# EAGLE design psu_ctrl_brd (EAGLE 7.2.0)

## Sheet 1 of 2
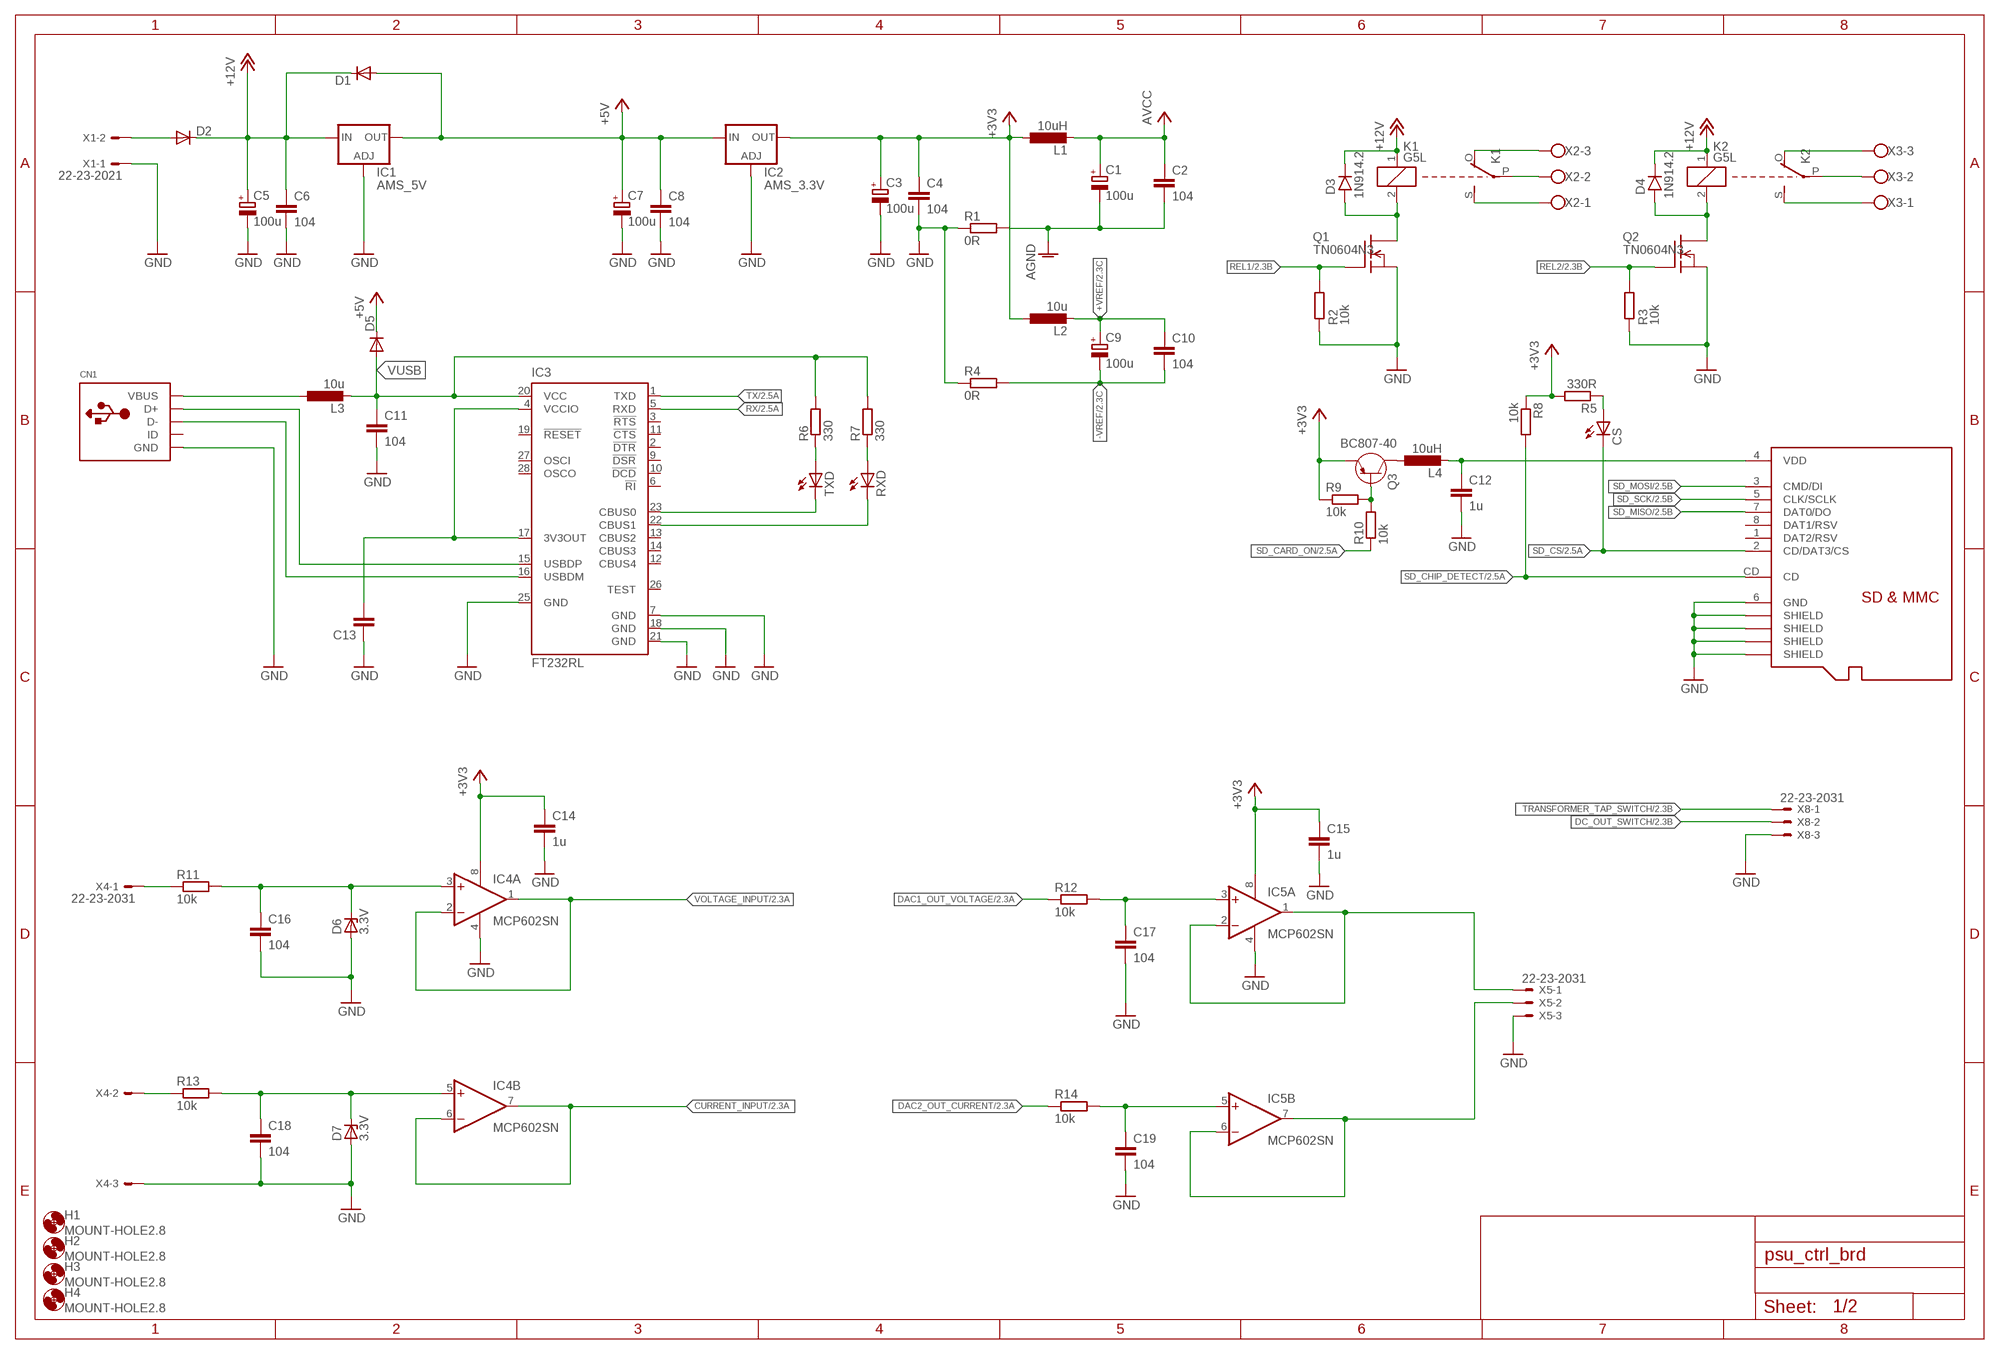
[diagram p0: schematic, sheet 1]

### Parts
C1  100u  CPOL-EU153CLV-0505  [153CLV-0505]
C2  104  C-EUC0805  [C0805]
C3  100u  CPOL-EU153CLV-0505  [153CLV-0505]
C4  104  C-EUC0805  [C0805]
C5  100u  CPOL-EU153CLV-0505  [153CLV-0505]
C6  104  C-EUC0805  [C0805]
C7  100u  CPOL-EU153CLV-0505  [153CLV-0505]
C8  104  C-EUC0805  [C0805]
C9  100u  CPOL-EU153CLV-0505  [153CLV-0505]
C10  104  C-EUC0805  [C0805]
C11  104  C-EUC0805  [C0805]
C12  1u  C-EUC0805  [C0805]
C13  C-EUC0805  [C0805]
C14  1u  C-EUC0805  [C0805]
C15  1u  C-EUC0805  [C0805]
C16  104  C-EUC0805  [C0805]
C17  104  C-EUC0805  [C0805]
C18  104  C-EUC0805  [C0805]
C19  104  C-EUC0805  [C0805]
CN1  USBMINIB  [USB-MINIB]
CS  LEDCHIPLED_1206  [CHIPLED_1206]
D1  DIODE-DO-214AC  [DO-214AC]
D2  DIODE-DO-214AC  [DO-214AC]
D3  1N914.2  [DO35-2]
D4  1N914.2  [DO35-2]
D5  DIODE-DO-214AC  [DO-214AC]
D6  3.3V  BZD23  [SOD81]
D7  3.3V  BZD23  [SOD81]
H1  MOUNT-HOLE2.8  [2,8]
H2  MOUNT-HOLE2.8  [2,8]
H3  MOUNT-HOLE2.8  [2,8]
H4  MOUNT-HOLE2.8  [2,8]
IC1  AMS_5V  LD117AS50TR  [SOT223]
IC2  AMS_3.3V  LD117AS50TR  [SOT223]
IC3  FT232RL  [SSOP28]
IC4  MCP602SN  [SO08]
IC5  MCP602SN  [SO08]
K1  G5L  [G5LE]
K2  G5L  [G5LE]
L1  10uH  L-EU0207/2V  [0207/2V]
L2  10u  L-EU0207/2V  [0207/2V]
L3  10u  L-EU0207/2V  [0207/2V]
L4  10uH  L-EU0207/2V  [0207/2V]
Q1  TN0604N3  [TO-92]
Q2  TN0604N3  [TO-92]
Q3  BC807-40  [SOT23]
R1  0R  R-EU_M0805  [M0805]
R2  10k  R-EU_R0805  [R0805]
R3  10k  R-EU_R0805  [R0805]
R4  0R  R-EU_M0805  [M0805]
R5  330R  R-EU_M0805  [M0805]
R6  330  R-EU_M0805  [M0805]
R7  330  R-EU_M0805  [M0805]
R8  10k  R-EU_M0805  [M0805]
R9  10k  R-EU_M0805  [M0805]
R10  10k  R-EU_M0805  [M0805]
R11  10k  R-EU_M0805  [M0805]
R12  10k  R-EU_M0805  [M0805]
R13  10k  R-EU_M0805  [M0805]
R14  10k  R-EU_M0805  [M0805]
RXD  LEDCHIPLED_1206  [CHIPLED_1206]
TXD  LEDCHIPLED_1206  [CHIPLED_1206]
U$1  MICROSD  [C12075]
X1  22-23-2021  [22-23-2021]
X2  AK500/3  [AK500/3]
X3  AK500/3  [AK500/3]
X4  22-23-2031  [22-23-2031]
X5  22-23-2031  [22-23-2031]
X8  22-23-2031  [22-23-2031]

### Nets
+3V3: C3.+ C4.1 C14.1 C15.1 IC2.4(OUT) IC4.8(P:V+) IC5.8(P:V+) L1.1 L2.1 Q3.2(E) R5.2 R8.1 R9.1 ; also sheet 2
+5V: C7.+ C8.1 D1.A D5.C IC1.4(OUT) IC2.3(IN) ; also sheet 2
+12V: C5.+ C6.1 D1.C D2.C D3.C D4.C IC1.3(IN) K1.1 K2.1 ; also sheet 2
+VREF: C9.+ C10.1 L2.2 ; also sheet 2
-VREF: C9.- C10.2 R4.2 ; also sheet 2
AGND: C1.- C2.2 R1.2 ; also sheet 2
AVCC: C1.+ C2.1 L1.2 ; also sheet 2
CURRENT_INPUT: IC4.6(B:-IN) IC4.7(B:OUT) ; also sheet 2
DAC1_OUT_VOLTAGE: R12.1 ; also sheet 2
DAC2_OUT_CURRENT: R14.1 ; also sheet 2
DC_OUT_SWITCH: X8.2 ; also sheet 2
GND: C3.- C4.2 C5.- C6.2 C7.- C8.2 C11.2 C12.2 C13.1 C14.2 C15.2 C16.2 C17.2 C18.2 C19.2 CN1.GND D6.A D7.A IC1.1(ADJ) IC2.1(ADJ) IC3.7(GND) IC3.18(GND) IC3.21(GND) IC3.25(GND) IC4.4(P:V-) IC5.4(P:V-) Q1.1(S) Q2.1(S) R1.1 R2.1 R3.1 R4.1 U$1.6(GND) U$1.GND@1(SHIELD) U$1.GND@2(SHIELD) U$1.GND@3(SHIELD) U$1.GND@4(SHIELD) X1.1 X4.3 X5.3 X8.3 ; also sheet 2
N$2: CN1.D+ IC3.15(USBDP)
N$3: CN1.VBUS L3.1
N$4: R7.1 RXD.A
N$5: C13.2 IC3.4(VCCIO) IC3.17(3V3OUT)
N$6: CN1.D- IC3.16(USBDM)
N$7: R6.1 TXD.A
N$8: D2.A X1.2
N$9: IC3.23(CBUS0) TXD.C
N$10: IC3.22(CBUS1) RXD.C
N$11: R11.1 X4.1
N$12: C16.1 D6.C IC4.3(A:+IN) R11.2
N$13: R13.1 X4.2
N$15: C18.1 D7.C IC4.5(B:+IN) R13.2
N$23: C17.1 IC5.3(A:+IN) R12.2
N$24: IC5.1(A:OUT) IC5.2(A:-IN) X5.1
N$26: C19.1 IC5.5(B:+IN) R14.2
N$27: IC5.6(B:-IN) IC5.7(B:OUT) X5.2
N$36: D4.A K2.2 Q2.3(D)
N$37: L4.1 Q3.3(C)
N$38: C12.1 L4.2 U$1.4(VDD)
N$40: K1.O(2:O) X2.3
N$41: K1.S(2:S) X2.1
N$42: D3.A K1.2 Q1.3(D)
N$43: K1.P(2:P) X2.2
N$44: K2.O(2:O) X3.3
N$45: K2.P(2:P) X3.2
N$46: K2.S(2:S) X3.1
N$47: Q3.1(B) R9.2 R10.2
N$48: CS.A R5.1
REL1: Q1.2(G) R2.2 ; also sheet 2
REL2: Q2.2(G) R3.2 ; also sheet 2
RX: IC3.5(RXD) ; also sheet 2
SD_CARD_ON: R10.1 ; also sheet 2
SD_CHIP_DETECT: R8.2 U$1.CD ; also sheet 2
SD_CS: CS.C U$1.2(CD/DAT3/CS) ; also sheet 2
SD_MISO: U$1.7(DAT0/DO) ; also sheet 2
SD_MOSI: U$1.3(CMD/DI) ; also sheet 2
SD_SCK: U$1.5(CLK/SCLK) ; also sheet 2
TRANSFORMER_TAP_SWITCH: X8.1 ; also sheet 2
TX: IC3.1(TXD) ; also sheet 2
VOLTAGE_INPUT: IC4.1(A:OUT) IC4.2(A:-IN) ; also sheet 2
VUSB: C11.1 D5.A IC3.20(VCC) L3.2 R6.2 R7.2
Unconnected: CN1.ID IC3.2(!DTR) IC3.3(!RTS) IC3.6(!RI) IC3.9(!DSR) IC3.10(!DCD) IC3.11(!CTS) IC3.12(CBUS4) IC3.13(CBUS2) IC3.14(CBUS3) IC3.19(!RESET) IC3.26(TEST) IC3.27(OSCI) IC3.28(OSCO) U$1.1(DAT2/RSV) U$1.8(DAT1/RSV)

## Sheet 2 of 2
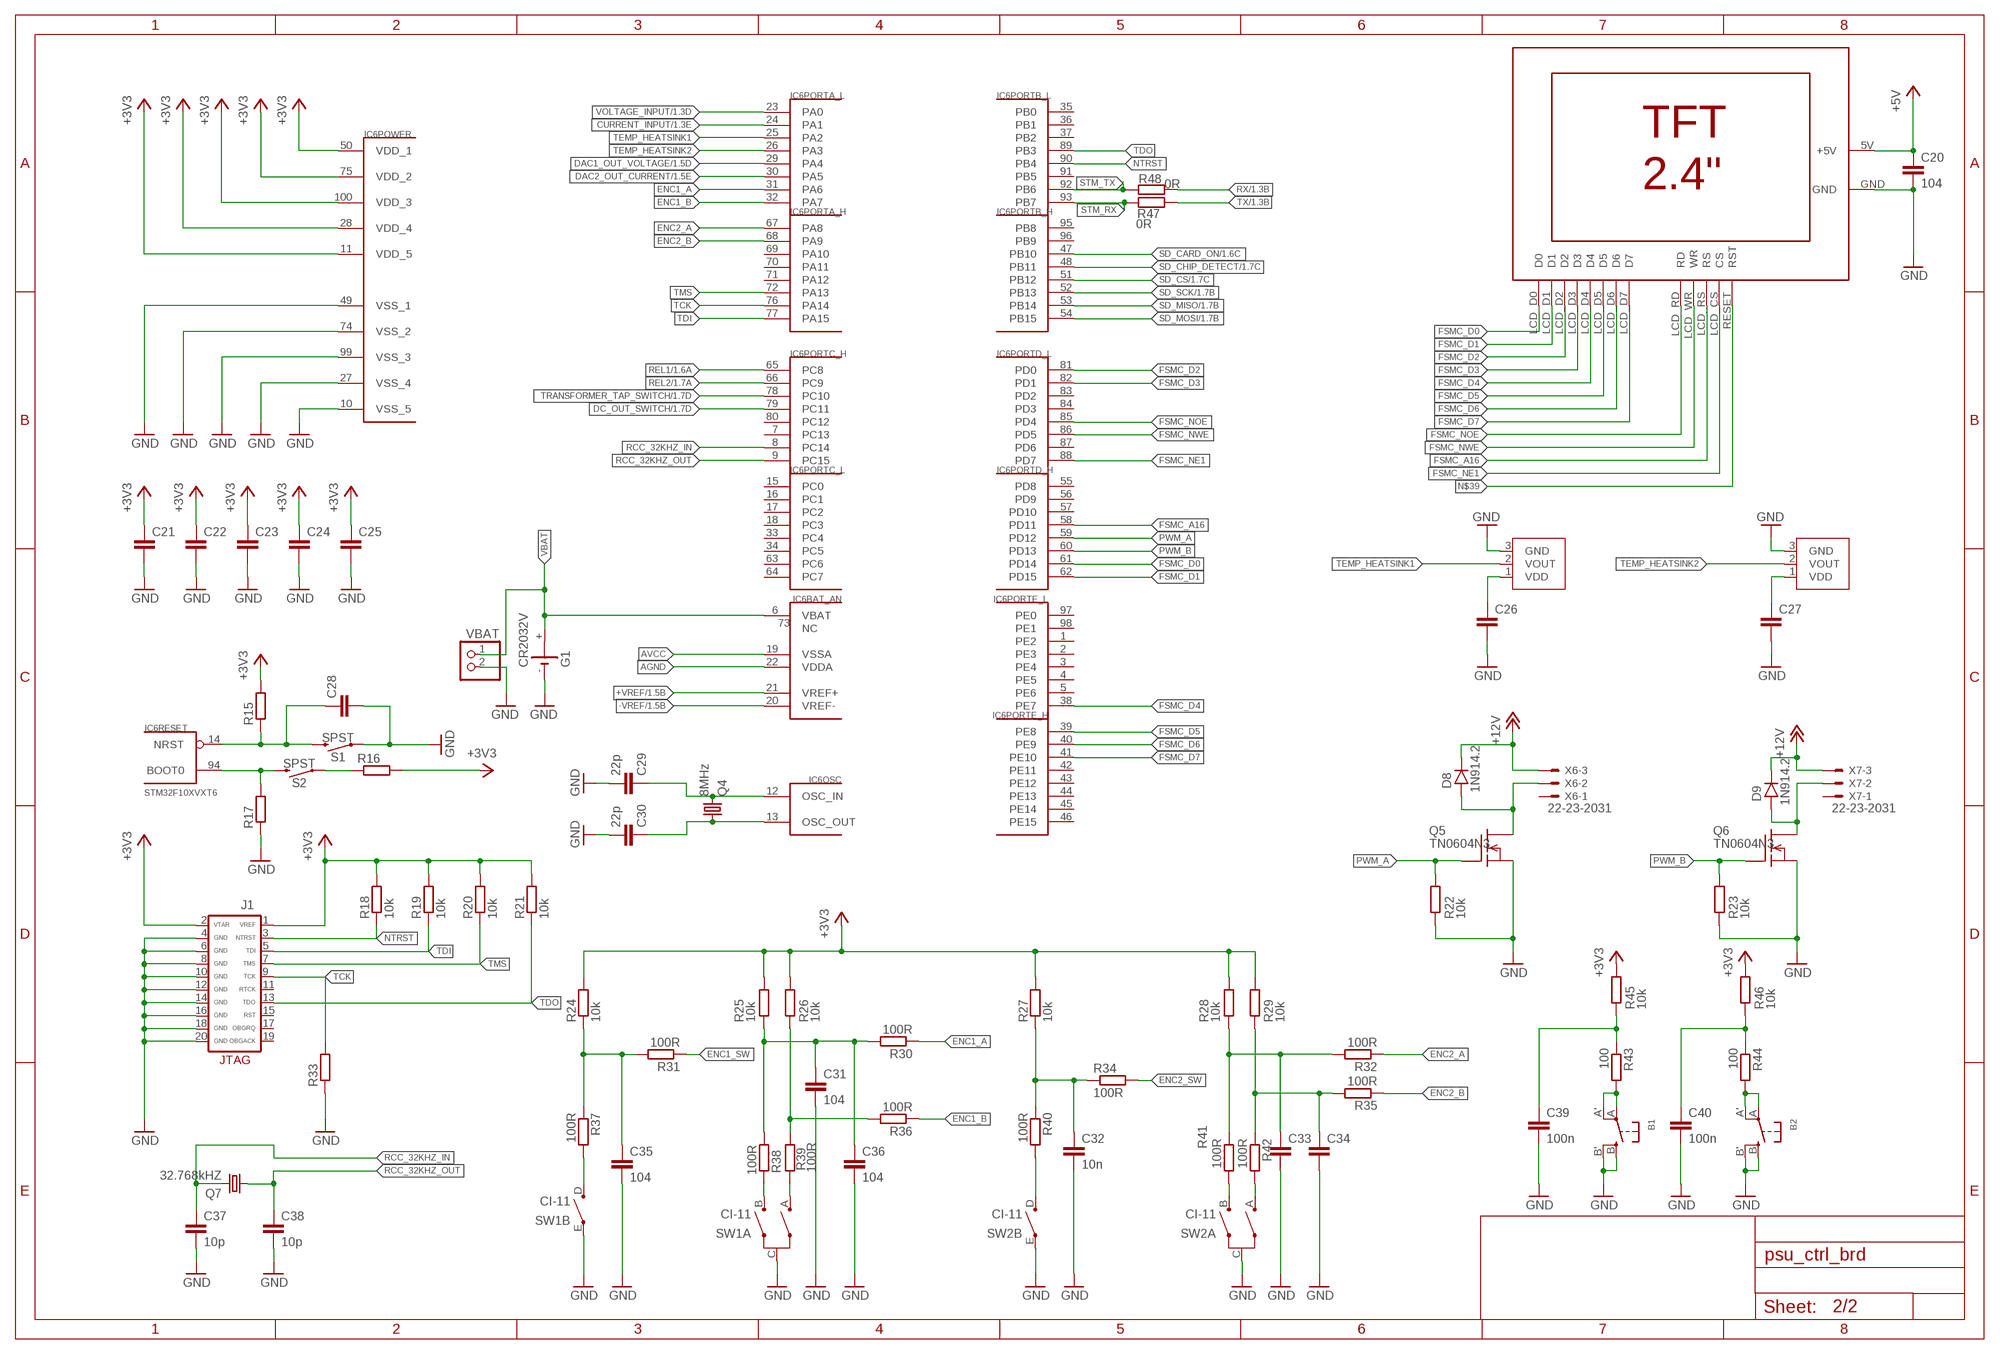
[diagram p1: schematic, sheet 2]

### Parts
B1  SWITCH_TACT_SMT  [EVQ-Q2]
B2  SWITCH_TACT_SMT  [EVQ-Q2]
C20  104  C-EUC0805  [C0805]
C21  C-EUC0805  [C0805]
C22  C-EUC0805  [C0805]
C23  C-EUC0805  [C0805]
C24  C-EUC0805  [C0805]
C25  C-EUC0805  [C0805]
C26  C-EUC0805  [C0805]
C27  C-EUC0805  [C0805]
C28  C-EUC0805  [C0805]
C29  22p  C-EUC0805  [C0805]
C30  22p  C-EUC0805  [C0805]
C31  104  C-EUC0805  [C0805]
C32  10n  C-EUC0805  [C0805]
C33  C-EUC0805  [C0805]
C34  C-EUC0805  [C0805]
C35  104  C-EUC0805  [C0805]
C36  104  C-EUC0805  [C0805]
C37  10p  C-EUC0805  [C0805]
C38  10p  C-EUC0805  [C0805]
C39  100n  C-EUC0805  [C0805]
C40  100n  C-EUC0805  [C0805]
D8  1N914.2  [DO35-2]
D9  1N914.2  [DO35-2]
G1  CR2032V  [CR2032V]
IC6  STM32F10XVXT6  [TQFP100]
J1  JTAG-ARM-PAK100/2500-20  [PAK100/2500-20]
MCP97X_1  MCP970XTO  [TO92]
MCP97X_2  MCP970XTO  [TO92]
Q4  8MHz  CSM-7X-DU  [CSM-7X-DU]
Q5  TN0604N3  [TO-92]
Q6  TN0604N3  [TO-92]
Q7  32.768kHZ  CRYSTALTC26V  [TC26V]
R15  R-EU_R0805  [R0805]
R16  R-EU_R0805  [R0805]
R17  R-EU_R0805  [R0805]
R18  10k  R-EU_R0805  [R0805]
R19  10k  R-EU_R0805  [R0805]
R20  10k  R-EU_R0805  [R0805]
R21  10k  R-EU_R0805  [R0805]
R22  10k  R-EU_R0805  [R0805]
R23  10k  R-EU_R0805  [R0805]
R24  10k  R-EU_R0805  [R0805]
R25  10k  R-EU_R0805  [R0805]
R26  10k  R-EU_R0805  [R0805]
R27  10k  R-EU_R0805  [R0805]
R28  10k  R-EU_R0805  [R0805]
R29  10k  R-EU_R0805  [R0805]
R30  100R  R-EU_R0805  [R0805]
R31  100R  R-EU_R0805  [R0805]
R32  100R  R-EU_R0805  [R0805]
R33  R-EU_R0805  [R0805]
R34  100R  R-EU_R0805  [R0805]
R35  100R  R-EU_R0805  [R0805]
R36  100R  R-EU_R0805  [R0805]
R37  100R  R-EU_R0805  [R0805]
R38  100R  R-EU_R0805  [R0805]
R39  100R  R-EU_R0805  [R0805]
R40  100R  R-EU_R0805  [R0805]
R41  100R  R-EU_R0805  [R0805]
R42  100R  R-EU_R0805  [R0805]
R43  100  R-EU_R0805  [R0805]
R44  100  R-EU_R0805  [R0805]
R45  10k  R-EU_R0805  [R0805]
R46  10k  R-EU_R0805  [R0805]
R47  0R  R-EU_R0805  [R0805]
R48  0R  R-EU_R0805  [R0805]
S1  SPST  MOMENTARY-SWITCH-SPST-SMD-6.0X3.5MM  [TACTILE_SWITCH_SMD_6.0X3.5MM]
S2  SPST  MOMENTARY-SWITCH-SPST-SMD-6.0X3.5MM  [TACTILE_SWITCH_SMD_6.0X3.5MM]
SW1  CI-11  [CI-11]
SW2  CI-11  [CI-11]
U$2  TFT24  [A]
VBAT  PINHD-1X2  [1X02]
X6  22-23-2031  [22-23-2031]
X7  22-23-2031  [22-23-2031]

### Nets
+3V3: C21.1 C22.1 C23.1 C24.1 C25.1 IC6.11(POWER:VDD_5) IC6.28(POWER:VDD_4) IC6.50(POWER:VDD_1) IC6.75(POWER:VDD_2) IC6.100(POWER:VDD_3) J1.1(VREF) J1.2(VTAR) R15.2 R16.2 R18.2 R19.2 R20.2 R21.2 R24.2 R25.2 R26.2 R27.2 R28.2 R29.2 R45.2 R46.2 ; also sheet 1
+5V: C20.1 U$2.5V(+5V) ; also sheet 1
+12V: D8.C D9.C X6.3 X7.3 ; also sheet 1
+VREF: IC6.21(BAT_AN:VREF+) ; also sheet 1
-VREF: IC6.20(BAT_AN:VREF-) ; also sheet 1
AGND: IC6.22(BAT_AN:VDDA) ; also sheet 1
AVCC: IC6.19(BAT_AN:VSSA) ; also sheet 1
CURRENT_INPUT: IC6.24(PORTA_L:PA1) ; also sheet 1
DAC1_OUT_VOLTAGE: IC6.29(PORTA_L:PA4) ; also sheet 1
DAC2_OUT_CURRENT: IC6.30(PORTA_L:PA5) ; also sheet 1
DC_OUT_SWITCH: IC6.79(PORTC_H:PC11) ; also sheet 1
ENC1_A: C31.1 C36.1 IC6.31(PORTA_L:PA6) R25.1 R30.1 R30.2 R38.1
ENC1_B: IC6.32(PORTA_L:PA7) R36.1
ENC1_SW: R31.1
ENC1B: R26.1 R36.2 R39.1
ENC2_A: IC6.67(PORTA_H:PA8) R32.1
ENC2_B: IC6.68(PORTA_H:PA9) R35.1
ENC2_SW: R34.2
FSMC_A16: IC6.58(PORTD_H:PD11) U$2.LCD_RS(RS)
FSMC_D0: IC6.61(PORTD_H:PD14) U$2.LCD_D0(D0)
FSMC_D1: IC6.62(PORTD_H:PD15) U$2.LCD_D1(D1)
FSMC_D2: IC6.81(PORTD_L:PD0) U$2.LCD_D2(D2)
FSMC_D3: IC6.82(PORTD_L:PD1) U$2.LCD_D3(D3)
FSMC_D4: IC6.38(PORTE_L:PE7) U$2.LCD_D4(D4)
FSMC_D5: IC6.39(PORTE_H:PE8) U$2.LCD_D5(D5)
FSMC_D6: IC6.40(PORTE_H:PE9) U$2.LCD_D6(D6)
FSMC_D7: IC6.41(PORTE_H:PE10) U$2.LCD_D7(D7)
FSMC_NE1: IC6.88(PORTD_L:PD7) U$2.LCD_CS(CS)
FSMC_NOE: IC6.85(PORTD_L:PD4) U$2.LCD_RD(RD)
FSMC_NWE: IC6.86(PORTD_L:PD5) U$2.LCD_WR(WR)
GND: B1.B'(S1) B1.B(S) B2.B'(S1) B2.B(S) C20.2 C21.2 C22.2 C23.2 C24.2 C25.2 C26.2 C27.2 C28.2 C29.2 C30.2 C31.2 C32.2 C33.2 C34.2 C35.2 C36.2 C37.2 C38.2 C39.2 C40.2 G1.- IC6.10(POWER:VSS_5) IC6.27(POWER:VSS_4) IC6.49(POWER:VSS_1) IC6.74(POWER:VSS_2) IC6.99(POWER:VSS_3) J1.4(GND) J1.6(GND) J1.8(GND) J1.10(GND) J1.12(GND) J1.14(GND) J1.16(GND) J1.18(GND) J1.20(GND) MCP97X_1.3(GND) MCP97X_2.3(GND) Q5.1(S) Q6.1(S) R17.1 R22.1 R23.1 R33.1 S1.1 SW1.C(A:C) SW1.E(B:E) SW2.C(A:C) SW2.E(B:E) U$2.GND VBAT.2 ; also sheet 1
N$1: D8.A Q5.3(D) X6.2
N$14: R38.2 SW1.B(A:B)
N$16: R39.2 SW1.A(A:A)
N$17: C28.1 IC6.14(RESET:NRST) R15.1 S1.2
N$18: IC6.94(RESET:BOOT0) R17.2 S2.2
N$19: R16.1 S2.1
N$20: C29.1 IC6.12(OSC:OSC_IN) Q4.2
N$21: C33.1 R28.1 R32.2 R41.1
N$22: C30.1 IC6.13(OSC:OSC_OUT) Q4.1
N$25: C34.1 R29.1 R35.2 R42.1
N$28: R41.2 SW2.B(A:B)
N$29: R42.2 SW2.A(A:A)
N$30: R37.2 SW1.D(B:D)
N$31: C35.1 R24.1 R31.2 R37.1
N$32: C32.1 R27.1 R34.1 R40.1
N$33: C27.1 MCP97X_2.1(VDD)
N$34: C26.1 MCP97X_1.1(VDD)
N$35: D9.A Q6.3(D) X7.2
N$39: U$2.RESET(RST)
N$49: R40.2 SW2.D(B:D)
N$52: B2.A'(P1) B2.A(P) R44.2
N$53: B1.A'(P1) B1.A(P) R43.2
N$54: C39.1 R43.1 R45.1
N$55: C40.1 R44.1 R46.1
NTRST: IC6.90(PORTB_L:PB4) J1.3(NTRST) R18.1
PWM_A: IC6.59(PORTD_H:PD12) Q5.2(G) R22.2
PWM_B: IC6.60(PORTD_H:PD13) Q6.2(G) R23.2
RCC_32KHZ_IN: C37.1 IC6.8(PORTC_H:PC14) Q7.2
RCC_32KHZ_OUT: C38.1 IC6.9(PORTC_H:PC15) Q7.1
REL1: IC6.65(PORTC_H:PC8) ; also sheet 1
REL2: IC6.66(PORTC_H:PC9) ; also sheet 1
RX: R48.2 ; also sheet 1
SD_CARD_ON: IC6.47(PORTB_H:PB10) ; also sheet 1
SD_CHIP_DETECT: IC6.48(PORTB_H:PB11) ; also sheet 1
SD_CS: IC6.51(PORTB_H:PB12) ; also sheet 1
SD_MISO: IC6.53(PORTB_H:PB14) ; also sheet 1
SD_MOSI: IC6.54(PORTB_H:PB15) ; also sheet 1
SD_SCK: IC6.52(PORTB_H:PB13) ; also sheet 1
STM_RX: IC6.93(PORTB_L:PB7) R47.1
STM_TX: IC6.92(PORTB_L:PB6) R48.1
TCK: IC6.76(PORTA_H:PA14) J1.9(TCK) R33.2
TDI: IC6.77(PORTA_H:PA15) J1.5(TDI) R19.1
TDO: IC6.89(PORTB_L:PB3) J1.13(TDO) R21.1
TEMP_HEATSINK1: IC6.25(PORTA_L:PA2) MCP97X_1.2(VOUT)
TEMP_HEATSINK2: IC6.26(PORTA_L:PA3) MCP97X_2.2(VOUT)
TMS: IC6.72(PORTA_H:PA13) J1.7(TMS) R20.1
TRANSFORMER_TAP_SWITCH: IC6.78(PORTC_H:PC10) ; also sheet 1
TX: R47.2 ; also sheet 1
VBAT: G1.+ IC6.6(BAT_AN:VBAT) VBAT.1
VOLTAGE_INPUT: IC6.23(PORTA_L:PA0) ; also sheet 1
Unconnected: G1.+@1(+) IC6.1(PORTE_L:PE2) IC6.2(PORTE_L:PE3) IC6.3(PORTE_L:PE4) IC6.4(PORTE_L:PE5) IC6.5(PORTE_L:PE6) IC6.7(PORTC_H:PC13) IC6.15(PORTC_L:PC0) IC6.16(PORTC_L:PC1) IC6.17(PORTC_L:PC2) IC6.18(PORTC_L:PC3) IC6.33(PORTC_L:PC4) IC6.34(PORTC_L:PC5) IC6.35(PORTB_L:PB0) IC6.36(PORTB_L:PB1) IC6.37(PORTB_L:PB2) IC6.42(PORTE_H:PE11) IC6.43(PORTE_H:PE12) IC6.44(PORTE_H:PE13) IC6.45(PORTE_H:PE14) IC6.46(PORTE_H:PE15) IC6.55(PORTD_H:PD8) IC6.56(PORTD_H:PD9) IC6.57(PORTD_H:PD10) IC6.63(PORTC_L:PC6) IC6.64(PORTC_L:PC7) IC6.69(PORTA_H:PA10) IC6.70(PORTA_H:PA11) IC6.71(PORTA_H:PA12) IC6.73(BAT_AN:NC) IC6.80(PORTC_H:PC12) IC6.83(PORTD_L:PD2) IC6.84(PORTD_L:PD3) IC6.87(PORTD_L:PD6) IC6.91(PORTB_L:PB5) IC6.95(PORTB_H:PB8) IC6.96(PORTB_H:PB9) IC6.97(PORTE_L:PE0) IC6.98(PORTE_L:PE1) J1.11(RTCK) J1.15(RST) J1.17(OBGRQ) J1.19(OBGACK) X6.1 X7.1

## Library data of the parts
B1 B2 = microbuilder:SWITCH_TACT_SMT: SMT Tact Switches 6x6mm - Digikey: P12940SCT-ND KMR2 (4.6x2.8mm) - Digikey: 401-1426-1-ND EVQ-PQHB55 - Light Touch, 160GF (4.5x4.5mm) - Digikey: P8090SCT-ND
C1 C3 C5 C7 C9 = rcl:CPOL-EU: POLARIZED CAPACITOR, European symbol
C2 C4 C6 C8 C10-C40 = rcl:C-EU: CAPACITOR, European symbol
CN1 = adafruit:USB: USB Connectors USBMINIB - Surface Mount Female Mini-B USB Connector 4UConnector: 06564 By microbuilder.eu Thru-hole RA Female Mini-B USB Connector 4UConnector: 18732 By ladyada.net
CS RXD TXD = led:LED: LED OSRAM: - CHIPLED LG R971, LG N971, LY N971, LG Q971, LY Q971, LO R971, LY R971 LH N974, LH R974 LS Q976, LO Q976, LY Q976 LO Q996 - Hyper CHIPLED LW Q18S LB Q993, LB Q99A, LB R99A - SideLED LS A670, LO A670, LY A670, LG A670, LP A670 LB A673, LV A673, LT A673, LW A673 LH A674 LY A675 LS A676, LA A676, LO A676, LY A676, LW A676 LS A679, LY A679, LG A679 - Hyper Micro SIDELED® LS Y876, LA Y876, LO Y876, LY Y876 LT Y87S - SmartLED LW L88C, LW L88S LB L89C, LB L89S, LG L890 LS L89K, LO L89K, LY L89K LS L896, LA L896, LO L896, LY L896 - TOPLED LS T670, LO T670, LY T670, LG T670, LP T670 LSG T670, LSP T670, LSY T670, LOP T670, LYG T670 LG T671, LOG T671, LSG T671 LB T673, LV T673, LT T673, LW T673 LH T674 LS T676, LA T676, LO T676, LY T676, LB T676, LH T676, LSB T676, LW T676 LB T67C, LV T67C, LT T67C, LS T67K, LO T67K, LY T67K, LW E67C LS E67B, LA E67B, LO E67B, LY E67B, LB E67C, LV E67C, LT E67C LW T67C LS T679, LY T679, LG T679 LS T770, LO T770, LY T770, LG T770, LP T770 LB T773, LV T773, LT T773, LW T773 LH T774 LS E675, LA E675, LY E675, LS T675 LS T776, LA T776, LO T776, LY T776, LB T776 LHGB T686 LT T68C, LB T68C - Hyper Mini TOPLED® LB M676 - Mini TOPLED Santana® LG M470 LS M47K, LO M47K, LY M47K Source: http://www.osram.convergy.de LUXEON: - LUMILED® LXK2-PW12-R00, LXK2-PW12-S00, LXK2-PW14-U00, LXK2-PW14-V00 LXK2-PM12-R00, LXK2-PM12-S00, LXK2-PM14-U00 LXK2-PE12-Q00, LXK2-PE12-R00, LXK2-PE12-S00, LXK2-PE14-T00, LXK2-PE14-U00 LXK2-PB12-K00, LXK2-PB12-L00, LXK2-PB12-M00, LXK2-PB14-N00, LXK2-PB14-P00, LXK2-PB14-Q00 LXK2-PR12-L00, LXK2-PR12-M00, LXK2-PR14-Q00, LXK2-PR14-R00 LXK2-PD12-Q00, LXK2-PD12-R00, LXK2-PD12-S00 LXK2-PH12-R00, LXK2-PH12-S00 LXK2-PL12-P00, LXK2-PL12-Q00, LXK2-PL12-R00 Source: www.luxeon.com KINGBRIGHT: KA-3528ASYC Source: www.kingbright.com
D1 D2 D5 = diode:DIODE-: DIODE
D3 D4 D8 D9 = gm-diodes:1N914: Fast Switching Diode DO-35 glass case a.k.a. 1N4148
D6 D7 = diode:BZD23: Z DIODE
G1 = battery:CR2032V: LI BATTERY Varta
H1-H4 = holes:MOUNT-HOLE: MOUNTING HOLE with drill center marker
IC1 IC2 = v-reg:LD117A?*: Low drop fixed and adjustable positive voltage regulators 1 A Source: http://www.st.com/stonline/products/literature/ds/7194/ld1117axx.pdf
IC3 = ftdichip:FT232R: Source: http://www.ftdichip.com/Documents/DataSheets/DS_FT232R_v104.pdf; MPN: FT232RL; OC_FARNELL: 1146032; OC_NEWARK: 91K9918
IC4 IC5 = linear:MCP602: Single Op Amp 2.7V to 6.0V Single Supply CMOS Source: http://ww1.microchip.com/downloads/en/DeviceDoc/21314g.pdf
IC6 = stm32:STM32F10XVXT6: STM32F101/103 100 pin LQFP
J1 = atmel-arm:JTAG-ARM-: JTAG Programming/Debug Connector
K1 K2 = relay:G5L: RELAY 1 x switch, 10 A/120 V AC, 8 A/30 V ADC, Omron; OC_FARNELL: unknown; OC_NEWARK: unknown
L1-L4 = rcl:L-EU: INDUCTOR, European symbol
MCP97X_1 MCP97X_2 = mcp970x:MCP970X
Q1 Q2 Q5 Q6 = transistor-fet+irf7201:TN0604N3: N-Channel Enhancement MOSFET 40V; 4A; 0,75Ohm
Q3 = semiconductor:BC807: PNP General Purpose Amplifier This device is designed for general purpose medium power amplifiers and switches requiring collector currents to 1.0 A. Symbol Parameter Value Units VCEO Collector-Emitter Voltage 45 V VCES Collector-Base Voltage 50 V VEBO Emitter-Base Voltage 5.0 V IC Collector Current - Continuous 1.2 A
Q4 = crystal:CSM-7X-DU: SMD CRYSTAL Source: www.ecsxtal.com .. Crystal 3.6864MHz CSM_7X_DU.PDF; OC_FARNELL: unknown; OC_NEWARK: unknown
Q7 = crystal:CRYSTAL: CRYSTAL; OC_FARNELL: unknown; OC_NEWARK: unknown
R1-R48 = rcl:R-EU_: RESISTOR, European symbol
S1 S2 = SparkFun-Switches:MOMENTARY-SWITCH-SPST: Momentary Switch (Pushbutton) - SPST Normally-open (NO) SPST momentary switches (buttons, pushbuttons). Variants PTH-12MM - 12mm square, through-hole Momentary Pushbutton Switch - 12mm Square <https://www.sparkfun.com/products/9190> (COM-09190) PTH-6.0MM, PTH-6.0MM-KIT - 6.0mm square, through-hole Mini Pushbutton Switch <https://www.sparkfun.com/products/97> (COM-00097) KIT package intended for soldering kit's - only one side of pads' copper is exposed. PTH-RIGHT-ANGLE-KIT - Right-angle, through-hole Right Angle Tactile Button <https://www.sparkfun.com/products/10791> - Used on SparkFun BigTime Watch Kit <https://www.sparkfun.com/products/11734> SMD-12MM - 12mm square, surface-mount Tactile Button - SMD (12mm) <https://www.sparkfun.com/products/12993> (COM-12993) Used on SparkFun PicoBoard <https://www.sparkfun.com/products/11888> SMD-4.5MM - 4.5mm Square Trackball Switch Used on SparkFun Blackberry Trackballer Breakout <https://www.sparkfun.com/products/13169> SMD-4.6MMX2.8MM - 4.60mm x 2.80mm, surface mount Used on SparkFun SAMD21 Mini Breakout <https://www.sparkfun.com/products/13664> SMD-5.2MM, SMD-5.2-REDUNDANT - 5.2mm square, surface-mount Mini Pushbutton Switch - SMD <https://www.sparkfun.com/products/8720> (COM-08720) Used on Arduino Pro Mini <https://www.sparkfun.com/products/11114> REDUNDANT package connects both switch circuits together SMD-6.0X3.5MM - 6.0 x 3.5mm, surface mount Momentary Reset Switch SMD <https://www.sparkfun.com/products/8229> (COM-08229) SMD-6.2MM-TALL - 6.2mm square, surface mount Tactile Button - SMD (6mm) <https://www.sparkfun.com/products/12992> Used on SparkFun Digital Sandbox <https://www.sparkfun.com/products/12651> SMD-RIGHT-ANGLE - Right-angle, surface mount Used on SparkFun Block for Intel® Edison - Arduino <https://www.sparkfun.com/products/13036>; PROD_ID: SWCH-00815; SF_SKU: COM-08229
SW1 SW2 = piher:CI-11: 11mm Incemental Encoder Source: www.piher.net .. 04-CI-11v04.pdf; OC_FARNELL: unknown; OC_NEWARK: unknown
U$1 = micro-sd:MICROSD: Micro-SD / Transflash card holder with SPI pinout For the 3M # 2908-05WB-MG and/or 4UCON #19656 push-push type
U$2 = adafruit:TFT24
VBAT = pinhead:PINHD-1X2: PIN HEADER
X1 = con-molex:22-23-2021: .100" (2.54mm) Center Header - 2 Pin; MF: MOLEX; MPN: 22-23-2021; OC_FARNELL: 1462926; OC_NEWARK: 25C3832
X2 X3 = con-ptr500+:AK500/3: CONNECTOR
X4-X8 = con-molex:22-23-2031: .100" (2.54mm) Center Header - 3 Pin; MF: MOLEX; MPN: 22-23-2031; OC_FARNELL: 1462950; OC_NEWARK: 30C0862

## Board
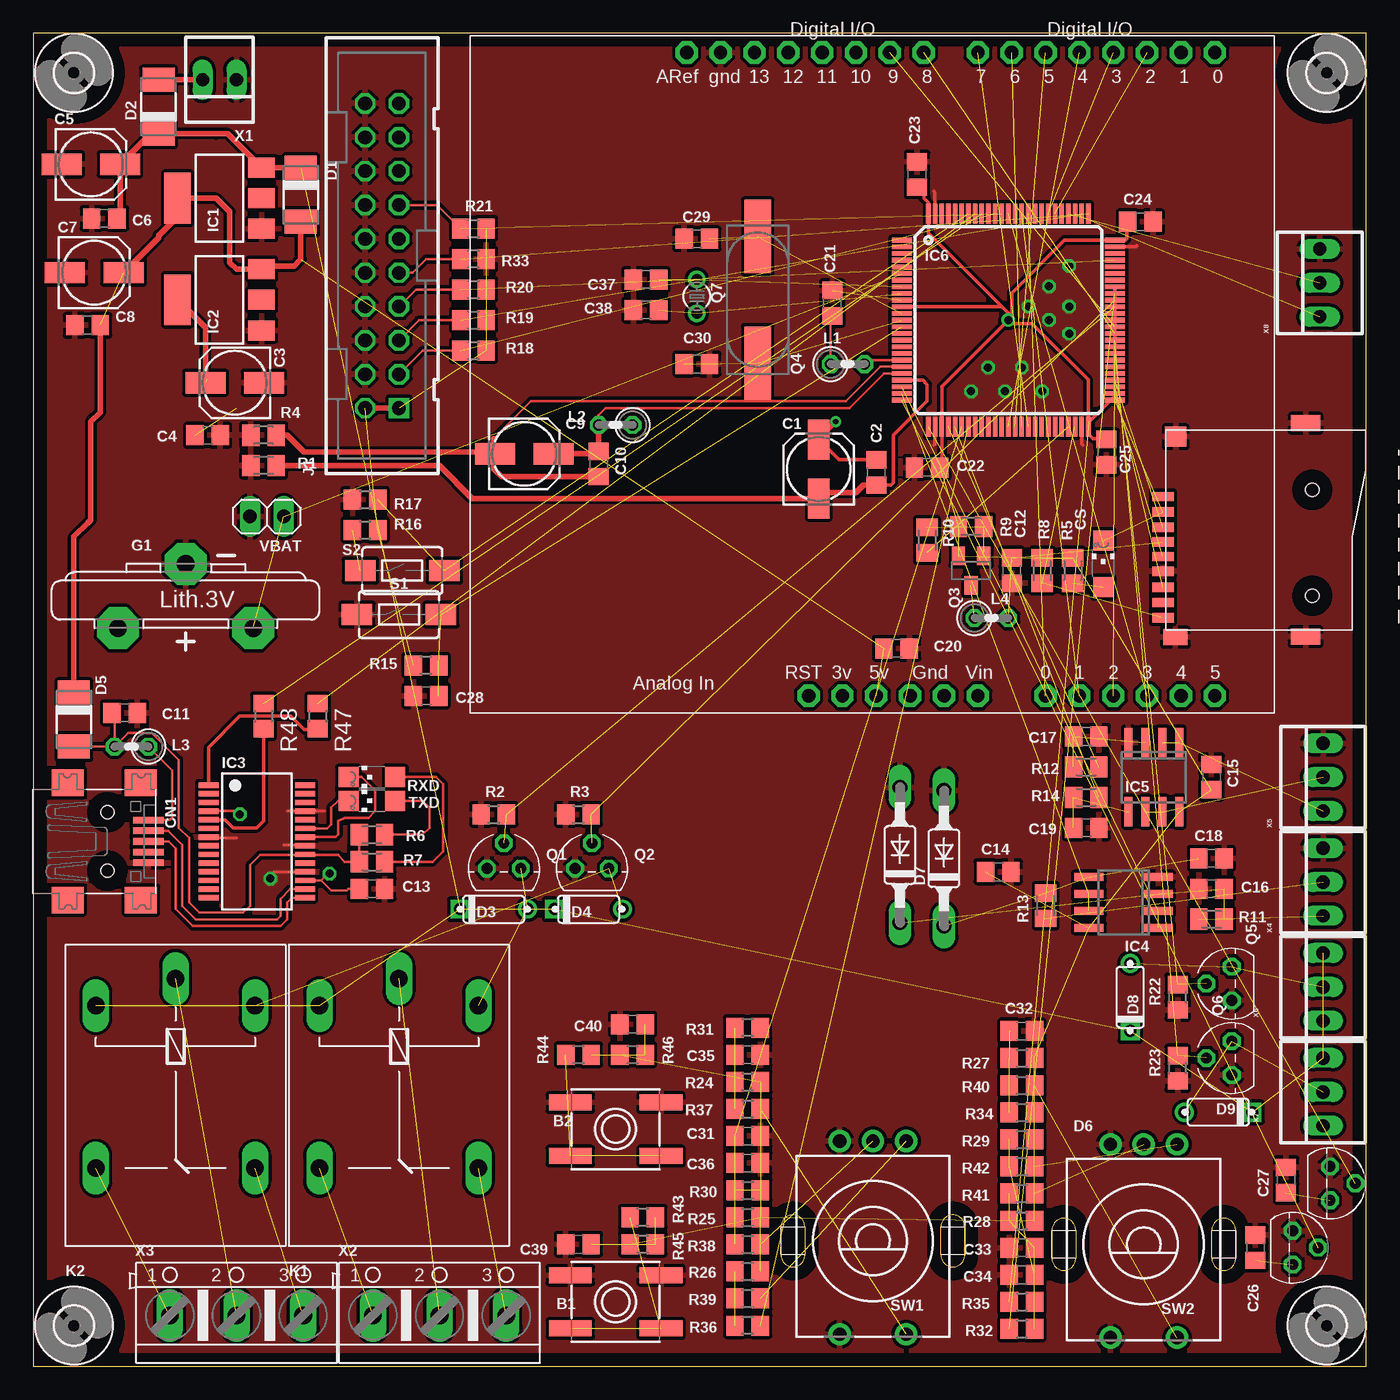
[diagram p2: board, top side]
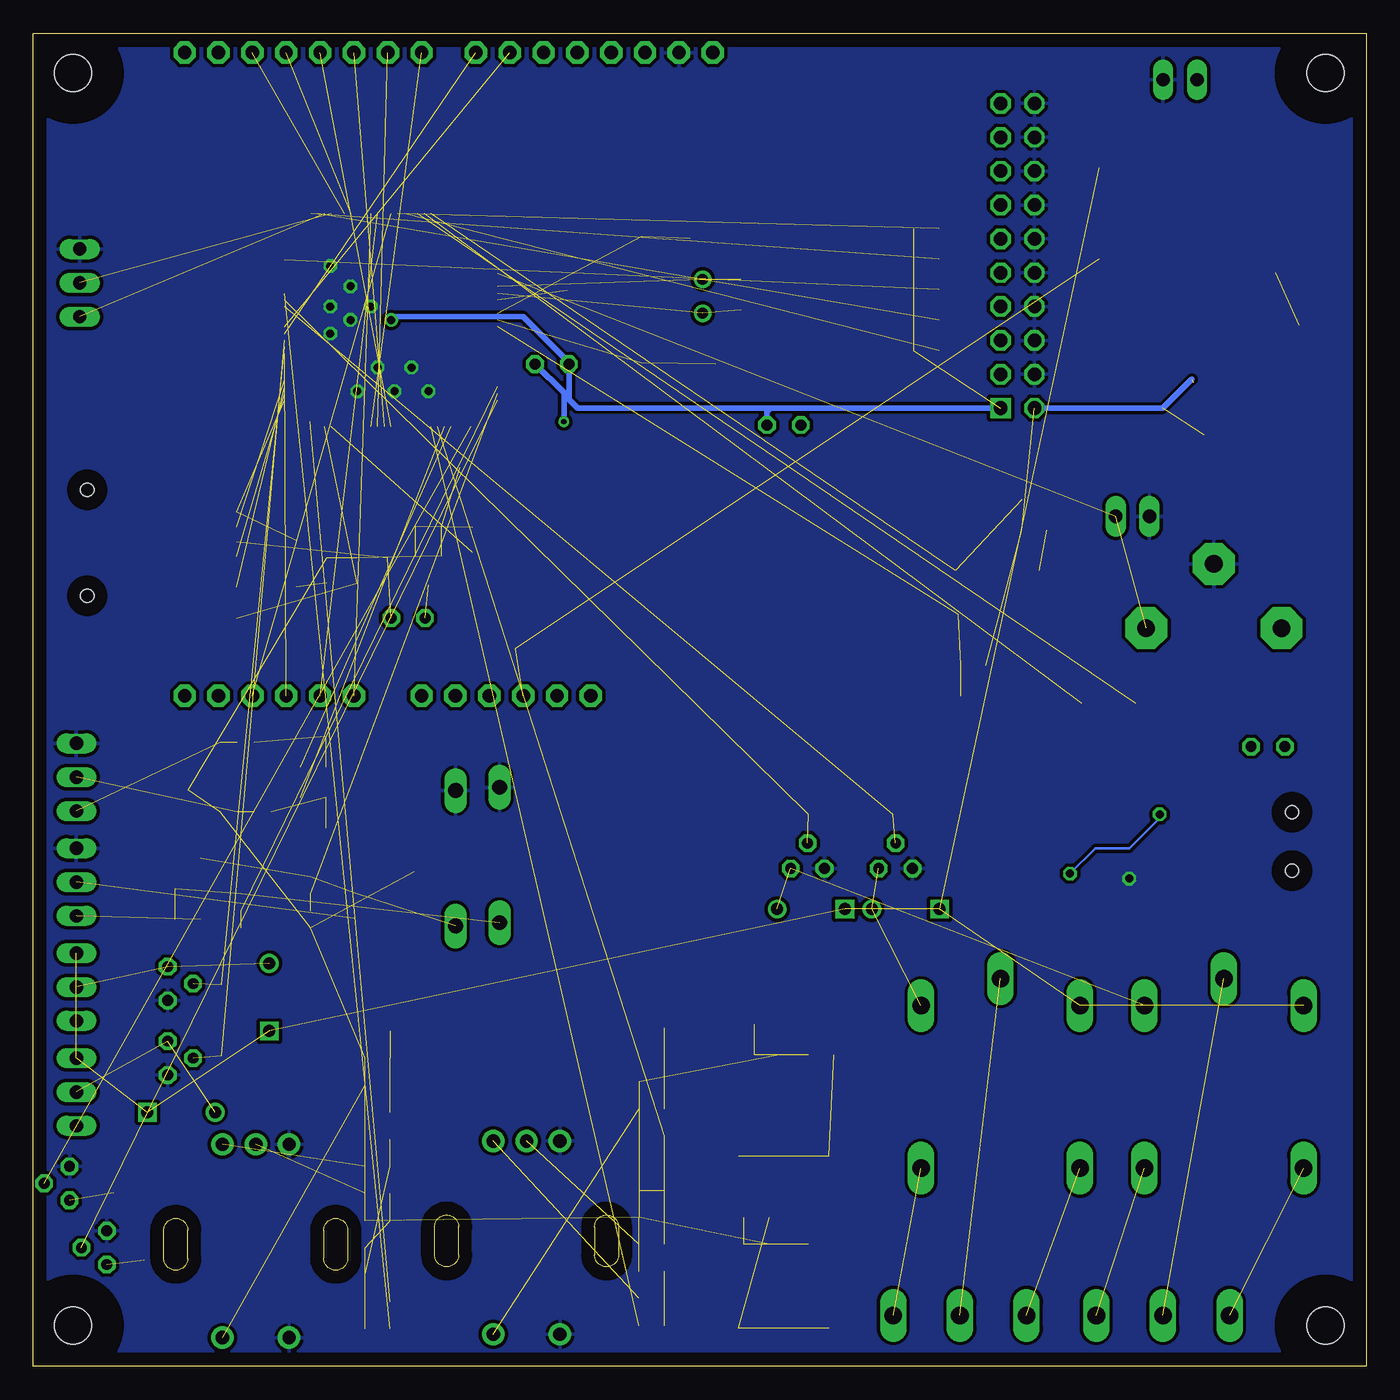
[diagram p3: board, bottom side, seen from below]

Size 100 x 100 mm. Coordinates in mm from the lower left corner, seen from the top.
Outline: 0,0 100,0 100,100 0,100 0,0
Copper layers (1*16): Top 0.035mm / dielectric 1.5mm / Bottom 0.035mm
Design rules "default": minimum track width 10mil, minimum drill 24mil, track to track 8mil, track to pad 8mil, pad to pad 8mil, via to via 8mil, smd to smd 8mil, copper to edge 40mil, drill to drill 8mil, minimum pad ring 10mil, minimum via ring 8mil, stop-mask expansion 4mil, vias tented up to drill 0mil, thermal gap 10mil

### Footprints (pad centres in the part's own frame; a part is rotated, then mirrored left to right if it is on the bottom)
EVQ-Q2 = smd 3.2 x 1.2: A -3.4,-2; A' 3.4,-2; B -3.4,2; B' 3.4,2
153CLV-0505 = smd 3 x 1.6: + 2.2,0; - -2.2,0
C0805 = smd 1.3 x 1.5: 1 -0.95,0; 2 0.95,0
USB-MINIB = smd 0.5 x 2.308: D+ 0,4.064; D- -0.8,4.064; GND 1.6,4.064; ID 0.8,4.064; VBUS -1.6,4.064 | smd 2 x 2.4: GND1 -4.4,-2; GND2 -4.4,3.5; GND3 4.4,3.5; GND4 4.4,-2 | hole 1: -2.2,1; 2.2,1
CHIPLED_1206 = smd 1.5 x 1.5: A 0,-1.75; C 0,1.75
DO-214AC = smd 1.8 x 2.4: A 2.025,0; C -2.025,0
DO35-2 = drill 0.9: A 2.54,0 | drill 0.9 square: C -2.54,0
SOD81 = drill 1.118 long: A 5.08,0; C -5.08,0
CR2032V = drill 1.321 pad 3.15 octagon: + -2.54,-5.08; +@1 -2.54,5.08; - 2.286,0
2,8 = hole 2.8: 0,0
SOT223 = smd 1.5 x 2: 1 -2.3,-3.15; 2 0,-3.15; 3 2.3,-3.15 | smd 3.8 x 2: 4 0,3.15
SSOP28 = smd 0.4 x 1.5: 1 -4.225,-3.625; 2 -3.575,-3.625; 3 -2.925,-3.625; 4 -2.275,-3.625; 5 -1.625,-3.625; 6 -0.975,-3.625; 7 -0.325,-3.625; 8 0.325,-3.625; 9 0.975,-3.625; 10 1.625,-3.625; 11 2.275,-3.625; 12 2.925,-3.625; 13 3.575,-3.625; 14 4.225,-3.625; 15 4.225,3.625; 16 3.575,3.625; 17 2.925,3.625; 18 2.275,3.625; 19 1.625,3.625; 20 0.975,3.625; 21 0.325,3.625; 22 -0.325,3.625; 23 -0.975,3.625; 24 -1.625,3.625; 25 -2.275,3.625; 26 -2.925,3.625; 27 -3.575,3.625; 28 -4.225,3.625
SO08 = smd 0.6 x 2.2: 1 -1.905,-2.6; 2 -0.635,-2.6; 3 0.635,-2.6; 4 1.905,-2.6; 5 1.905,2.6; 6 0.635,2.6; 7 -0.635,2.6; 8 -1.905,2.6
TQFP100 = smd 1.5 x 0.35: 1 -8,6; 2 -8,5.5; 3 -8,5; 4 -8,4.5; 5 -8,4; 6 -8,3.5; 7 -8,3; 8 -8,2.5; 9 -8,2; 10 -8,1.5; 11 -8,1; 12 -8,0.5; 13 -8,0; 14 -8,-0.5; 15 -8,-1; 16 -8,-1.5; 17 -8,-2; 18 -8,-2.5; 19 -8,-3; 20 -8,-3.5; 21 -8,-4; 22 -8,-4.5; 23 -8,-5; 24 -8,-5.5; 25 -8,-6; 51 8,-6; 52 8,-5.5; 53 8,-5; 54 8,-4.5; 55 8,-4; 56 8,-3.5; 57 8,-3; 58 8,-2.5; 59 8,-2; 60 8,-1.5; 61 8,-1; 62 8,-0.5; 63 8,0; 64 8,0.5; 65 8,1; 66 8,1.5; 67 8,2; 68 8,2.5; 69 8,3; 70 8,3.5; 71 8,4; 72 8,4.5; 73 8,5; 74 8,5.5; 75 8,6 | smd 0.35 x 1.5: 26 -6,-8; 27 -5.5,-8; 28 -5,-8; 29 -4.5,-8; 30 -4,-8; 31 -3.5,-8; 32 -3,-8; 33 -2.5,-8; 34 -2,-8; 35 -1.5,-8; 36 -1,-8; 37 -0.5,-8; 38 0,-8; 39 0.5,-8; 40 1,-8; 41 1.5,-8; 42 2,-8; 43 2.5,-8; 44 3,-8; 45 3.5,-8; 46 4,-8; 47 4.5,-8; 48 5,-8; 49 5.5,-8; 50 6,-8; 76 6,8; 77 5.5,8; 78 5,8; 79 4.5,8; 80 4,8; 81 3.5,8; 82 3,8; 83 2.5,8; 84 2,8; 85 1.5,8; 86 1,8; 87 0.5,8; 88 0,8; 89 -0.5,8; 90 -1,8; 91 -1.5,8; 92 -2,8; 93 -2.5,8; 94 -3,8; 95 -3.5,8; 96 -4,8; 97 -4.5,8; 98 -5,8; 99 -5.5,8; 100 -6,8
PAK100/2500-20 = drill 1.016 pad 1.422 square: 1 -11.43,-1.27 | drill 1.016 pad 1.422 octagon: 2 -11.43,1.27; 3 -8.89,-1.27; 4 -8.89,1.27; 5 -6.35,-1.27; 6 -6.35,1.27; 7 -3.81,-1.27; 8 -3.81,1.27; 9 -1.27,-1.27; 10 -1.27,1.27; 11 1.27,-1.27; 12 1.27,1.27; 13 3.81,-1.27; 14 3.81,1.27; 15 6.35,-1.27; 16 6.35,1.27; 17 8.89,-1.27; 18 8.89,1.27; 19 11.43,-1.27; 20 11.43,1.27
G5LE = drill 1.321 long: 1 -7.493,-5.969; 2 -7.493,5.969; O 4.699,5.969; P -9.525,0; S 4.699,-5.969
0207/2V = drill 0.813 octagon: 1 -1.27,0; 2 1.27,0
TO92 = drill 0.813 octagon: 1 1.27,0; 2 0,1.905; 3 -1.27,0
TO-92 = drill 0.813 octagon: 1 -1.27,0; 2 0,1.905; 3 1.27,0
SOT23 = smd 1 x 1.4: 1 -0.95,-1.1; 2 0.95,-1.1; 3 0,1.1
CSM-7X-DU = smd 5.5 x 2: 1 -4.75,0; 2 4.75,0
TC26V = drill 0.813: 1 -1.27,0; 2 1.27,0
M0805 = smd 1.3 x 1.6: 1 -0.95,0; 2 0.95,0
R0805 = smd 1.3 x 1.5: 1 -0.95,0; 2 0.95,0
TACTILE_SWITCH_SMD_6.0X3.5MM = smd 2.3 x 1.6: 1 -3.15,0; 2 3.15,0
CI-11 = drill 1 pad 1.676: A -2.5,-7.5; B 0,-7.5; C 2.5,-7.5; D -2.5,7; E 2.5,7
C12075 = smd 0.7 x 1.6: 1 2.5,7.7; 2 1.35,7.7; 3 0.2,7.7; 4 -0.9,7.7; 5 -2,7.7; 6 -3.1,7.7; 7 -4.3,7.7; 8 -5.45,7.7; CD -6.6,7.7 | smd 1.2 x 1.8: GND@1 -8.05,6.77 | smd 1.2 x 2.2: GND@2 -8,-3; GND@4 8,-3 | smd 1.5 x 1.6: GND@3 6.99,6.75 | hole 1: -4.95,-3.5; 3,-3.5; 3,-3.5
A = drill 1 pad 1.676 octagon: 3V 27.94,1.27; 5V 30.48,1.27; A5 55.88,1.27; AREF 16.256,49.53; D0 55.88,49.53; D1 53.34,49.53; D10 28.956,49.53; D11 26.416,49.53; D12 23.876,49.53; D13 21.336,49.53; GND 18.796,49.53; GND1 35.56,1.27; GND2 33.02,1.27; LCD_CS 50.8,1.27; LCD_D0 34.036,49.53; LCD_D1 31.496,49.53; LCD_D2 50.8,49.53; LCD_D3 48.26,49.53; LCD_D4 45.72,49.53; LCD_D5 43.18,49.53; LCD_D6 40.64,49.53; LCD_D7 38.1,49.53; LCD_RD 43.18,1.27; LCD_RS 48.26,1.27; LCD_WR 45.72,1.27; RESET 25.4,1.27; RST 53.34,1.27; VIN 38.1,1.27
1X02 = drill 1.016 long: 1 -1.27,0; 2 1.27,0
22-23-2021 = drill 1 long: 1 -1.27,0; 2 1.27,0
AK500/3 = drill 1.321 long: 1 -5.004,0; 2 0,0; 3 5.004,0
22-23-2031 = drill 1 long: 1 -2.54,0; 2 0,0; 3 2.54,0

### Placement (x,y rotation side)
B1  43.69,4.83 0 top
B2  43.69,17.78 0 top
C1  58.93,67.31 90 top
C2  63.25,67.06 270 top
C3  15.11,73.79 180 top
C4  13.08,69.85 0 top
C5  4.32,90.17 0 top
C6  5.33,86.11 180 top
C7  4.57,82.04 0 top
C8  4.06,78.11 180 top
C9  36.83,68.45 0 top
C10  42.42,67.69 270 top
C11  6.86,49.02 0 top
C12  73.41,59.69 270 top
C13  25.4,35.81 180 top
C14  72.39,37.08 0 top
C15  88.39,44.2 90 top
C16  88.39,35.81 180 top
C17  78.99,47.24 0 top
C18  88.39,38.1 0 top
C19  78.99,40.39 0 top
C20  64.77,53.85 0 top
C21  59.94,79.76 90 top
C22  67.06,67.44 180 top
C23  66.29,89.41 90 top
C24  83.06,85.85 0 top
C25  80.52,68.58 270 top
C26  91.69,8.89 90 top
C27  93.98,13.97 90 top
C28  29.46,50.29 180 top
C29  49.78,84.58 180 top
C30  49.78,75.18 0 top
C31  53.59,17.27 0 top
C32  74.17,25.15 0 top
C33  74.17,8.89 180 top
C34  74.17,6.86 180 top
C35  53.59,23.37 0 top
C36  53.59,15.24 0 top
C37  45.97,81.53 180 top
C38  45.97,79.25 180 top
C39  40.89,9.14 180 top
C40  44.96,25.65 180 top
CN1  4.57,39.37 270 top
CS  80.26,60.2 0 top
D1  20.07,87.88 270 top
D2  9.4,94.49 90 top
D3  34.54,34.29 0 top
D4  41.66,34.29 0 top
D5  3.05,48.51 270 top
D6  65.02,38.35 90 top
D7  68.33,38.1 90 top
D8  82.3,27.69 90 top
D9  88.9,19.05 180 top
G1  11.43,57.91 90 top
H1  3.05,97.03 0 top
H2  97.03,97.03 0 top
H3  97.03,3.05 0 top
H4  3.05,3.05 0 top
IC1  13.97,87.63 90 top
IC2  13.97,80.01 90 top
IC3  16.76,39.37 270 top
IC4  81.79,34.8 90 top
IC5  84.07,44.2 180 top
IC6  73.15,78.49 0 top
J1  26.16,83.31 90 top
K1  27.43,19.56 270 top
K2  10.67,19.56 270 top
L1  61.09,75.18 0 top
L2  43.69,70.61 180 top
L3  7.37,46.48 180 top
L4  71.88,56.13 0 top
MCP97X_1  94.49,8.89 270 top
MCP97X_2  97.28,13.72 270 top
Q1  35.31,37.34 0 top
Q2  41.91,37.34 0 top
Q3  70.36,59.69 180 top
Q4  54.36,80.01 90 top
Q5  89.92,28.7 90 top
Q6  89.92,23.11 90 top
Q7  49.78,80.26 90 top
R1  17.27,67.56 0 top
R2  34.54,41.4 0 top
R3  40.89,41.4 0 top
R4  17.27,69.85 0 top
R5  77.98,59.69 90 top
R6  25.4,39.88 180 top
R7  25.4,37.85 180 top
R8  75.69,59.69 270 top
R9  70.36,62.99 0 top
R10  67.06,61.98 90 top
R11  88.39,33.53 0 top
R12  78.99,44.96 180 top
R13  75.95,34.54 90 top
R14  78.99,42.67 180 top
R15  29.46,52.58 180 top
R16  24.89,62.74 0 top
R17  24.89,65.02 0 top
R18  33.02,76.2 0 top
R19  33.02,78.49 0 top
R20  33.02,80.77 0 top
R21  33.02,85.34 0 top
R22  85.85,27.69 90 top
R23  85.85,22.35 90 top
R24  53.59,21.34 0 top
R25  53.59,11.18 0 top
R26  53.59,7.11 0 top
R27  74.17,23.11 0 top
R28  74.17,10.92 0 top
R29  74.17,17.02 0 top
R30  53.59,13.21 0 top
R31  53.59,25.4 180 top
R32  74.17,2.79 0 top
R33  33.02,83.06 180 top
R34  74.17,19.05 0 top
R35  74.17,4.83 0 top
R36  53.59,3.05 180 top
R37  53.59,19.3 0 top
R38  53.59,9.14 0 top
R39  53.59,5.08 0 top
R40  74.17,21.08 0 top
R41  74.17,12.95 0 top
R42  74.17,14.99 0 top
R43  45.72,11.18 180 top
R44  40.89,23.37 180 top
R45  45.72,9.14 180 top
R46  44.96,23.37 180 top
R47  21.34,48.77 270 top
R48  17.27,48.77 270 top
RXD  25.4,44.2 90 top
S1  27.43,56.39 0 top
S2  27.69,59.69 0 top
SW1  62.99,9.4 180 top
SW2  83.31,9.14 180 top
TXD  25.4,42.42 90 top
U$1  92.46,62.74 90 top
U$2  32.77,49.02 0 top
VBAT  17.53,63.75 180 top
X1  13.97,96.52 180 top
X2  30.48,3.81 0 top
X3  15.24,3.81 0 top
X4  96.77,36.32 90 top
X5  96.77,44.2 90 top
X6  96.77,28.45 90 top
X7  96.77,20.57 90 top
X8  96.52,81.28 90 top

### Tracks (layer width: path | path; a pad name or v marks a point on that pad's centre or on a via)
+3V3  (via drill 0.6)  (24 unrouted)
  Top 0.203: L1.1 59.82,78.68 C21.1
  Top 0.254: v73.15,78.49 73.15,78.99 72.66,79.49 | IC6.11 72.66,79.49 | C24.1 82.04,85.79 82.04,84.58 81.95,84.49 IC6.75 77.37,84.49 73.41,80.52 73.41,78.74 v73.15,78.49 | C23.1 66.8,87.95 66.8,87.63 67.15,87.28 IC6.100 67.15,84.99 72.66,79.49 | C25.1 80.45,69.6 79.5,69.6 79.15,69.95 IC6.50 79.15,74.01 74.93,78.23 73.41,78.23 v73.15,78.49 | v73.15,78.49 68.15,73.49 IC6.28 68.15,67.58 C22.1
  Top 0.406: 10.82,78.38 IC2.4 12.91,77.92 C3.+ | J1.2 J1.1
  Bottom 0.406: J1.2 15.24,71.88 13.08,74.04 | J1.1 44.7,71.88 | 44.7,71.88 59.18,71.88 59.82,72.52 L1.1 59.82,75.31 63.25,78.74 72.9,78.74 v73.15,78.49 | L2.1 44.96,71.63 44.7,71.88
+5V  (3 unrouted)
  Top 0.406: D1.A 20.07,83.06 19.56,82.55 17.36,82.55 IC2.3 17.11,82.3 15.24,82.3 14.73,82.8 14.73,86.61 13.72,87.63 IC1.4 10.82,86.26 9.4,84.84 9.4,84.67 C7.+ | D5.C 3.05,62.23 4.06,63.25 4.32,63.5 4.32,70.87 5.01,71.56 C8.1
+12V  (8 unrouted)
  Top 0.406: D1.C 20.05,89.93 IC1.3 14.59,92.46 13.72,92.46 13.71,92.46 D2.C 8.81,92.46 C5.+ 6.52,86.34 C6.1
+VREF
  Top 0.203: L2.2 42.42,71.37 42.93,71.88 61.21,71.88 63.82,74.49 IC6.21
  Top 0.406: C9.+ 42.23,68.45 C10.1 L2.2
-VREF
  Top 0.203: IC6.20 63.56,74.99 60.96,72.39 37.34,72.39 34.54,69.6 | 34.54,68.54 C9.- | 34.54,68.37 C9.- | 34.5,68.58 C9.-
  Top 0.406: 34.54,69.6 34.54,68.54 | C10.2 35.11,66.74 34.54,67.31 34.54,68.37 | R4.2 19.05,69.85 20.32,68.58 34.5,68.58
AGND
  Top 0.254: C2.2 64.33,66.11 64.52,66.29 64.52,69.85 67.06,72.39 67.06,73.66 66.73,73.99 IC6.22 | 59.35,65.53 C1.-
  Top 0.406: C2.2 62.3,66.11 61.72,65.53 59.35,65.53 | C1.- 32.93,65.11 30.48,67.56 R1.2
AVCC  (via drill 0.4)
  Top 0.203: IC6.19 62.66,75.49 L1.2
  Top 0.254: C2.1 60.43,68.01 C1.+
  Top 0.406: C1.+ 58.93,69.6 v60.2,70.87
  Bottom 0.406: v60.2,70.87 60.2,73.03 L1.2
CURRENT_INPUT  (2 unrouted)
DAC1_OUT_VOLTAGE  (1 unrouted)
DAC2_OUT_CURRENT  (1 unrouted)
DC_OUT_SWITCH  (1 unrouted)
ENC1_A  (6 unrouted)
ENC1_B  (1 unrouted)
ENC1B  (2 unrouted)
ENC2_A  (1 unrouted)
ENC2_B  (1 unrouted)
  Top 0.254: IC6.68 81.15,72.77 79.25,70.87
FSMC_A16  (1 unrouted)
FSMC_D0  (1 unrouted)
FSMC_D1  (1 unrouted)
FSMC_D2  (1 unrouted)
FSMC_D3  (1 unrouted)
FSMC_D4  (1 unrouted)
FSMC_D5  (1 unrouted)
FSMC_D6  (1 unrouted)
FSMC_D7  (1 unrouted)
FSMC_NE1  (1 unrouted)
FSMC_NOE  (1 unrouted)
FSMC_NWE  (1 unrouted)
GND  (via drill 0.6)  (1 unrouted)
  Top 0.203: 21.84,41.66 20.4,41.66 IC3.25 20.38,41.66 19.05,41.66 | IC3.7 13.21,39.62 15.24,39.62 | IC3.18 20.38,37.08 18.03,37.08 17.78,36.83 v17.78,36.58 | IC3.21 20.32,39.12 18.8,39.12
  Top 0.254: IC6.99 67.65,88.05 67.56,88.14 | IC6.74 82.72,83.99 82.8,84.07 | IC6.49 78.65,69.18 78.74,69.09 | IC6.27 67.65,69.18 67.56,69.09
  other vias: 70.36,73.15 72.9,73.15 75.69,73.15 71.63,74.93 74.17,74.93 74.68,79.5 76.2,81.03 77.72,82.55 77.72,79.5 77.72,77.47 76.2,78.49
  pour Top (isolate 0.254): 0,100.08 100.08,100.08 100.08,-0.51 0,-0.51
  pour Bottom (isolate 0.254): 0,100.08 100.33,100.08 100.33,-0.51 0,-0.51
N$1  (2 unrouted)
N$2
  Top 0.203: CN1.D+ 10.16,39.37 10.67,38.86 10.67,34.29 11.94,33.02 18.54,33.02 19.05,33.53 19.05,34.8 19.4,35.15 IC3.15
N$3
  Top 0.203: CN1.VBUS 10.24,40.97 10.41,41.15 10.41,44.7 L3.1
N$4
  Top 0.203: R7.1 29.97,37.85 30.73,38.61 30.73,43.69 30.23,44.2 RXD.A
N$5  (via drill 0.6)
  Top 0.203: 21.59,36.45 22.35,35.69 23.5,35.69 23.62,35.81 C13.2 | IC3.17 21.59,36.45 | 21.59,36.45 22.1,36.96 v22.23,36.96 | v15.49,41.4 15.25,41.65 IC3.4
  Bottom 0.203: v22.23,36.96 20.32,38.86 17.78,38.86 15.49,41.15 v15.49,41.4
N$6
  Top 0.203: CN1.D- 10.12,40.17 11.18,39.12 11.18,34.54 12.19,33.53 18.29,33.53 18.54,33.78 18.54,35.05 19.29,35.8 IC3.16
N$7
  Top 0.203: R6.1 29.21,39.88 29.72,40.39 29.72,41.91 29.21,42.42 TXD.A
N$8
  Top 0.406: X1.2 D2.A
N$9
  Top 0.203: IC3.23 22.06,40.34 22.35,40.64 22.35,41.91 22.86,42.42 TXD.C
N$10
  Top 0.203: RXD.C 24.64,44.2 25.65,43.18 25.65,41.66 25.15,41.15 23.37,41.15 22.86,40.89 22.86,39.88 22.68,39.7 IC3.22
N$11  (1 unrouted)
N$12  (3 unrouted)
N$13  (1 unrouted)
N$14  (1 unrouted)
N$15  (3 unrouted)
N$16  (1 unrouted)
N$17  (3 unrouted)
N$18  (2 unrouted)
N$19  (1 unrouted)
N$20  (2 unrouted)
N$21  (3 unrouted)
N$22  (2 unrouted)
N$23  (2 unrouted)
N$24  (2 unrouted)
N$25  (3 unrouted)
N$26  (2 unrouted)
N$27  (2 unrouted)
N$28  (1 unrouted)
N$29  (1 unrouted)
N$30  (1 unrouted)
N$31  (3 unrouted)
N$32  (3 unrouted)
N$33  (1 unrouted)
N$34  (1 unrouted)
N$35  (2 unrouted)
N$36  (2 unrouted)
N$37  (1 unrouted)
N$38  (2 unrouted)
N$40  (1 unrouted)
N$41  (1 unrouted)
N$42  (2 unrouted)
N$43  (1 unrouted)
N$44  (1 unrouted)
N$45  (1 unrouted)
N$46  (1 unrouted)
N$47  (2 unrouted)
N$48  (1 unrouted)
N$49  (1 unrouted)
N$52  (2 unrouted)
N$53  (2 unrouted)
N$54  (2 unrouted)
N$55  (2 unrouted)
NTRST  (1 unrouted)
  Top 0.203: J1.3 29.21,76.2 R18.1
PWM_A  (2 unrouted)
PWM_B  (2 unrouted)
RCC_32KHZ_IN  (2 unrouted)
RCC_32KHZ_OUT  (2 unrouted)
REL1  (2 unrouted)
REL2  (2 unrouted)
RX
  Top 0.254: IC3.5 14.38,40.99 14.99,40.39 16.76,40.39 17.27,40.89 R48.2
SD_CARD_ON  (1 unrouted)
SD_CHIP_DETECT  (2 unrouted)
SD_CS  (2 unrouted)
SD_MISO  (1 unrouted)
SD_MOSI  (1 unrouted)
SD_SCK  (1 unrouted)
STM_RX  (1 unrouted)
STM_TX  (1 unrouted)
TCK  (1 unrouted)
  Top 0.203: R33.2 29.46,83.06 28.45,82.04 J1.9
TDI  (1 unrouted)
  Top 0.203: J1.5 28.96,78.49 R19.1
TDO  (1 unrouted)
  Top 0.203: R21.1 30.29,87.12 J1.13
TEMP_HEATSINK1  (1 unrouted)
TEMP_HEATSINK2  (1 unrouted)
TMS  (1 unrouted)
  Top 0.203: J1.7 28.7,80.77 R20.1
TRANSFORMER_TAP_SWITCH  (1 unrouted)
TX
  Top 0.254: IC3.1 13.14,46.41 15.49,48.77 19.3,48.77 20.32,47.75 21.27,47.75 R47.2
VBAT  (2 unrouted)
VOLTAGE_INPUT  (2 unrouted)
VUSB
  Top 0.203: L3.2 D5.A | L3.2 6.1,48.83 C11.1 | L3.2 7.11,47.5 8.89,47.5 10.92,45.47 10.92,40.39 11.68,39.62 11.68,34.8 12.45,34.04 15.75,34.04 16.26,34.54 16.26,37.59 17.02,38.35 20.35,38.35 IC3.20 20.43,38.35 22.86,38.35 23.37,37.85 R7.2 R6.2